# Altium schematic sheet RS485.SchDoc
size A; SheetNumber: 5; SheetTotal: 6
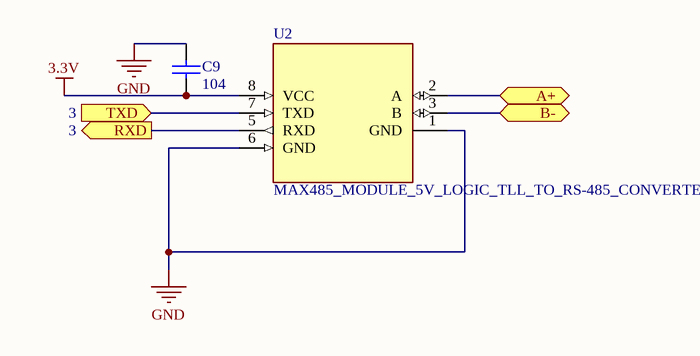
[diagram p0: RS485.SchDoc]

## Parts
C9  104  [tu gom]
U2  MAX485_MODULE_5V_LOGIC_TLL_TO_RS-485_CONVERTER  [MODULE_MAX485_MODULE_5V_LOGIC_TLL_TO_RS-485_CONVERTER]

## Ports
A+ (bidir), B- (bidir), RXD (out, see 3), TXD (in, see 3)

## Nets
3.3V: C9.2 U2.8(VCC)
GND: C9.1 U2.1(GND) U2.6(GND)
A+: U2.2(A) ; port A+
B-: U2.3(B) ; port B-
RXD: U2.5(RXD) ; port RXD
TXD: U2.7(TXD) ; port TXD

## Library data of the parts
C9 = Tu gom 104 50V: Cắm; So_Chan: 2; Ten_Linh_Kien: Tụ gốm 104 100nF 50V; Don_Vi: Con; Ma_Hang: MH004761; Chung_Loai: Cắm; Kieu_Chan: *
U2 = MAX485_MODULE_5V_LOGIC_TLL_TO_RS-485_CONVERTER: 5V MAX485 TTL To RS485 Converter Module Board for Arduino; MP: MAX485 Module 5V logic TLL to RS-485 converter; MF: e-Gizmo Mechatronix Central; Value: *; SnapEDA_Link: https://www.snapeda.com/parts/MAX485%20Module%205V%20logic%20TLL%20to%20RS-485%20converter/e-Gizmo+Mechatronix+Central/view-part/?ref=snap; Package: Package; Availability: Not in stock; Check_prices: https://www.snapeda.com/parts/MAX485%20Module%205V%20logic%20TLL%20to%20RS-485%20converter/e-Gizmo+Mechatronix+Central/view-part/?ref=eda; Price: None